# Altium schematic sheet Power.SchDoc
size A4
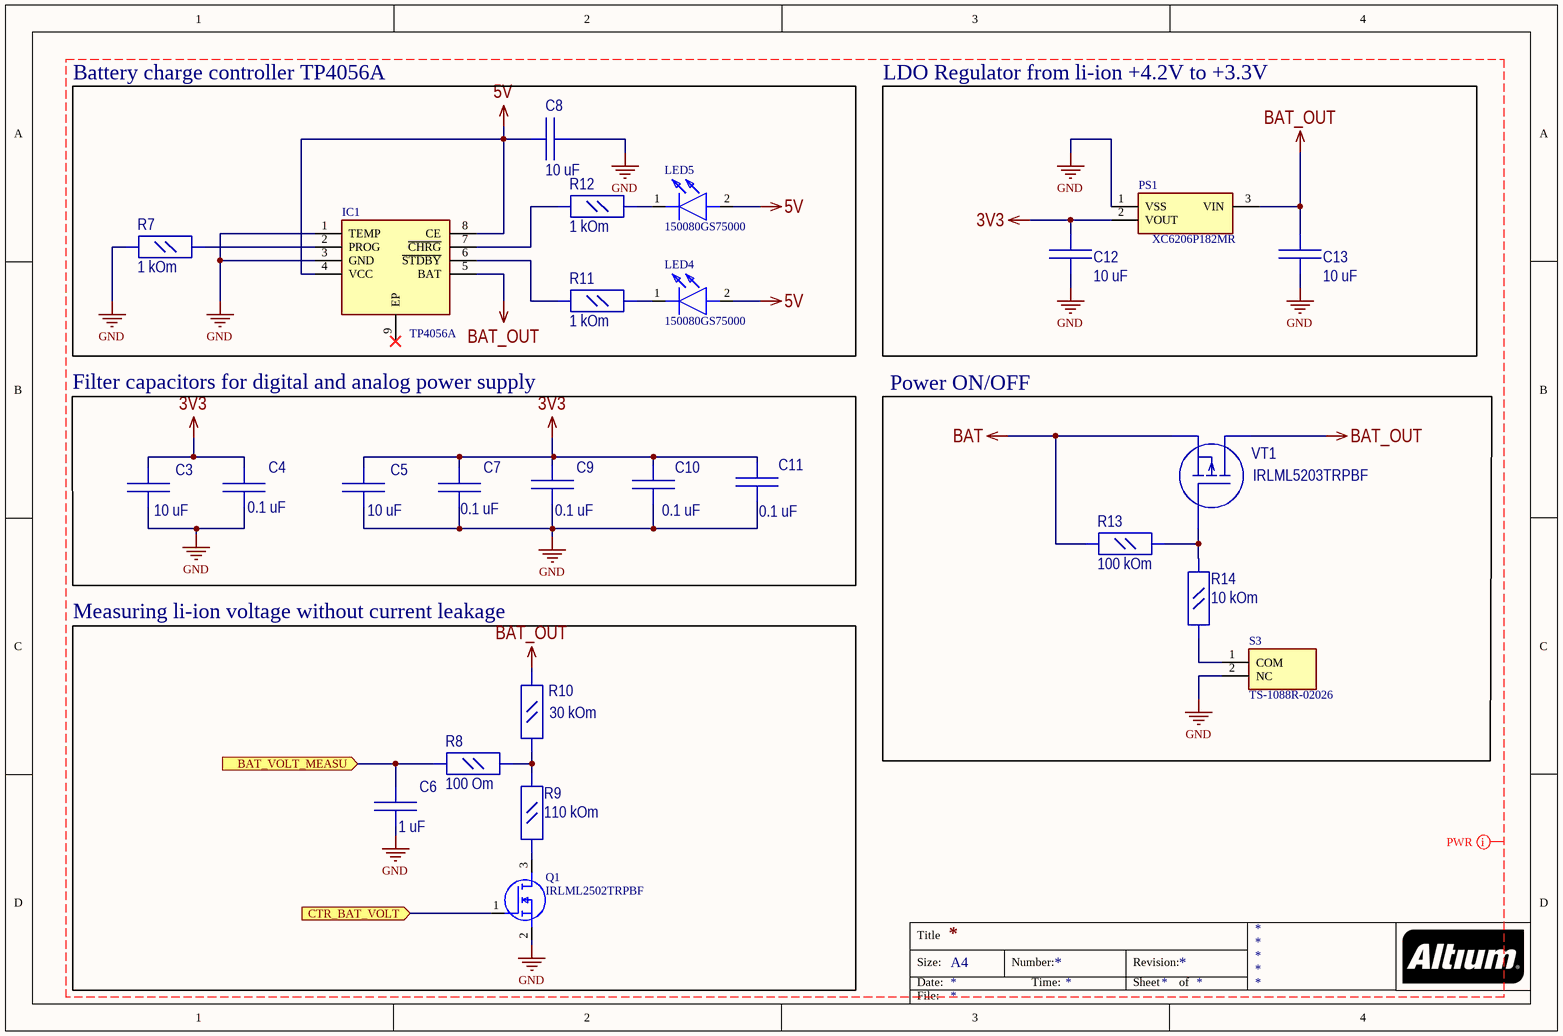
[diagram p0: Power.SchDoc]

## Parts
C3  10 uF  [C_0805]
C4  0.1 uF  [C_0805]
C5  10 uF  [C_0805]
C6  1 uF  [C_0805]
C7  0.1 uF  [C_0805]
C8  10 uF  [C_0805]
C9  0.1 uF  [C_0805]
C10  0.1 uF  [C_0805]
C11  0.1 uF  [C_0805]
C12  10 uF  [C_0805]
C13  10 uF  [C_0805]
IC1  TP4056A  [SOIC127P600X175-9N]
LED4  150080GS75000  [LEDM2012X80N]
LED5  150080GS75000  [LEDM2012X80N]
PS1  XC6206P182MR  [SOT95P280X130-3N]
Q1  IRLML2502TRPBF  [SOT95P237X112-3N]
R7  1 kOm  [R_0805]
R8  100 Om  [R_0805]
R9  110 kOm  [R_0805]
R10  30 kOm  [R_0805]
R11  1 kOm  [R_0805]
R12  1 kOm  [R_0805]
R13  100 kOm  [R_0805]
R14  10 kOm  [R_0805]
S3  TS-1088R-02026  [TS1088R02026]
VT1  IRLML5203TRPBF  [SOT23]

## Blocks framed on the sheet
Battery charge controller TP4056A: C8 IC1 LED4 LED5 R7 R11 R12
LDO Regulator from li-ion +4.2V to +3.3V: C12 C13 PS1
Filter capacitors for digital and analog power supply: C3-C5 C7 C9-C11
Power ON/OFF: R13 R14 S3 VT1
Measuring li-ion voltage without current leakage: C6 Q1 R8-R10

## Ports
BAT_VOLT_MEASU (in), CTR_BAT_VOLT (in)

## Nets
3V3: C3.2 C4.2 C5.2 C7.2 C9.2 C10.2 C11.2 C12.1 PS1.2(VOUT)
5V: C8.2 IC1.4(VCC) IC1.8(CE) LED4.2(A) LED5.2(A)
BAT: R13.2 VT1.2(S)
BAT_OUT: C13.1 IC1.5(BAT) PS1.3(VIN) R10.2 VT1.3(D)
GND: C3.1 C4.1 C5.1 C6.1 C7.1 C8.1 C9.1 C10.1 C11.1 C12.2 C13.2 IC1.1(TEMP) IC1.3(GND) PS1.1(VSS) Q1.2(S) R7.2 S3.2(NC)
BAT_VOLT_MEASU: C6.2 R8.2 ; port BAT_VOLT_MEASU
CTR_BAT_VOLT: Q1.1(G) ; port CTR_BAT_VOLT
NetIC1_2: IC1.2(PROG) R7.1
NetIC1_6: IC1.6(~{STDBY}) R11.2
NetIC1_7: IC1.7(~{CHRG}) R12.2
NetLED4_1: LED4.1(K) R11.1
NetLED5_1: LED5.1(K) R12.1
NetQ1_3: Q1.3(D) R9.1
NetR8_1: R8.1 R9.2 R10.1
NetR13_1: R13.1 R14.2 VT1.1(G)
NetR14_1: R14.1 S3.1(COM)

Not connected (* = marked no-connect by the designer): IC1 9(EP)*

## Layout directives
net class PWR: 3V3, 5V, BAT, BAT_OUT, GND

## Notes on the sheet
- Title
- Size:
- Date:
- A4
- Number:
- Time:
- Revision:
- Sheet
- of
- File:

## Library data of the parts
C3 C5 = C_0805: Value: 10mF
C4 C6 C7 C9-C11 = C_0805: Value: 100nF
C8 C12 C13 = C_0805
IC1 = TP4056A: Integrated Circuit; Manufacturer_Name: ams; Datasheet Link: https://www.naylampmechatronics.com/img/cms/Datasheets/TC4056A-AMS.pdf; Height: 1.75mm; Manufacturer_Part_Number: TP4056A
LED4 LED5 = 150080GS75000: LED; Manufacturer_Name: Wurth Elektronik; Datasheet Link: https://katalog.we-online.com/led/datasheet/150080GS75000.pdf; Height: 0.8mm; Manufacturer_Part_Number: 150080GS75000; Mouser Part Number: 710-150080GS75000; Mouser Price/Stock: https://www.mouser.co.uk/ProductDetail/Wurth-Elektronik/150080GS75000?qs=2kOmHSv6VfQRoTEZVk1mGA%3D%3D
PS1 = XC6206P182MR: Power Supply; Manufacturer_Name: Torex; Datasheet Link: https://componentsearchengine.com/Datasheets/2/XC6206P182MR.pdf; Height: 1.3mm; Manufacturer_Part_Number: XC6206P182MR
Q1 = IRLML2502TRPBF: MOSFET (N-Channel); Manufacturer_Name: Infineon; Datasheet Link: http://uk.rs-online.com/web/p/products/1623274; Height: 1.12mm; Manufacturer_Part_Number: IRLML2502TRPBF; Mouser Part Number: 942-IRLML2502TRPBF; Mouser Price/Stock: https://www.mouser.co.uk/ProductDetail/Infineon-IR/IRLML2502TRPBF?qs=9%252BKlkBgLFf37zQw9UlZd%2FQ%3D%3D; Arrow Part Number: IRLML2502TRPBF; Arrow Price/Stock: https://www.arrow.com/en/products/irlml2502trpbf/infineon-technologies-ag?region=nac
R7 R11 R12 R14 = R_0805
  R14: Value: 10 kOm
R8 = R_0805: Value: 47 kOm
R9 R13 = R_0805: Value: 10 kOm
R10 = R_0805: Value: 510 kOm
S3 = TS-1088R-02026: Switch; Manufacturer_Name: XUNPU; Datasheet Link: https://datasheet.lcsc.com/szlcsc/1912111437_XUNPU-TS-1088R-02026_C455280.pdf; Height: 2.2mm; Manufacturer_Part_Number: TS-1088R-02026
VT1 = IRLML5203TRPBF: Транзистор, P-канал 30В 3A logic